# Altium schematic sheet screen.SchDoc
size A4; SheetNumber: 3; SheetTotal: 3
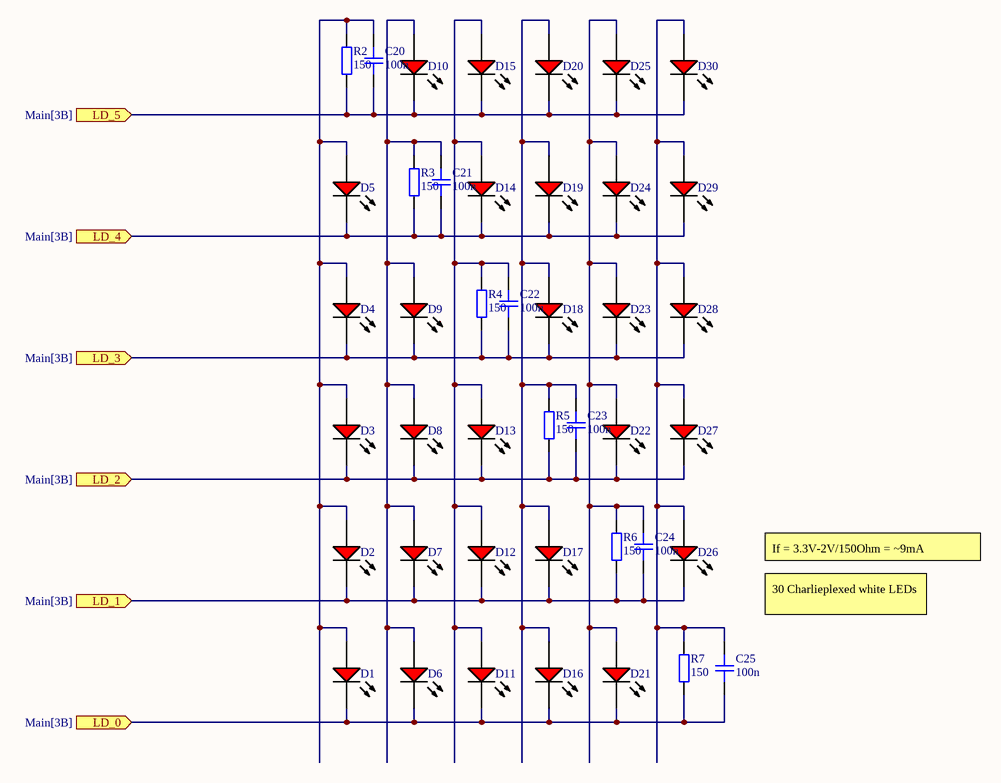
[diagram p0: screen.SchDoc]

## Parts
C20  100n  [CAP_0603]
C21  100n  [CAP_0603]
C22  100n  [CAP_0603]
C23  100n  [CAP_0603]
C24  100n  [CAP_0603]
C25  100n  [CAP_0603]
D1  SML-LX1206IC-TR  [LUMX-SML-LX1206IC_V]  (value not drawn)
D2  SML-LX1206IC-TR  [LUMX-SML-LX1206IC_V]  (value not drawn)
D3  SML-LX1206IC-TR  [LUMX-SML-LX1206IC_V]  (value not drawn)
D4  SML-LX1206IC-TR  [LUMX-SML-LX1206IC_V]  (value not drawn)
D5  SML-LX1206IC-TR  [LUMX-SML-LX1206IC_V]  (value not drawn)
D6  SML-LX1206IC-TR  [LUMX-SML-LX1206IC_V]  (value not drawn)
D7  SML-LX1206IC-TR  [LUMX-SML-LX1206IC_V]  (value not drawn)
D8  SML-LX1206IC-TR  [LUMX-SML-LX1206IC_V]  (value not drawn)
D9  SML-LX1206IC-TR  [LUMX-SML-LX1206IC_V]  (value not drawn)
D10  SML-LX1206IC-TR  [LUMX-SML-LX1206IC_V]  (value not drawn)
D11  SML-LX1206IC-TR  [LUMX-SML-LX1206IC_V]  (value not drawn)
D12  SML-LX1206IC-TR  [LUMX-SML-LX1206IC_V]  (value not drawn)
D13  SML-LX1206IC-TR  [LUMX-SML-LX1206IC_V]  (value not drawn)
D14  SML-LX1206IC-TR  [LUMX-SML-LX1206IC_V]  (value not drawn)
D15  SML-LX1206IC-TR  [LUMX-SML-LX1206IC_V]  (value not drawn)
D16  SML-LX1206IC-TR  [LUMX-SML-LX1206IC_V]  (value not drawn)
D17  SML-LX1206IC-TR  [LUMX-SML-LX1206IC_V]  (value not drawn)
D18  SML-LX1206IC-TR  [LUMX-SML-LX1206IC_V]  (value not drawn)
D19  SML-LX1206IC-TR  [LUMX-SML-LX1206IC_V]  (value not drawn)
D20  SML-LX1206IC-TR  [LUMX-SML-LX1206IC_V]  (value not drawn)
D21  SML-LX1206IC-TR  [LUMX-SML-LX1206IC_V]  (value not drawn)
D22  SML-LX1206IC-TR  [LUMX-SML-LX1206IC_V]  (value not drawn)
D23  SML-LX1206IC-TR  [LUMX-SML-LX1206IC_V]  (value not drawn)
D24  SML-LX1206IC-TR  [LUMX-SML-LX1206IC_V]  (value not drawn)
D25  SML-LX1206IC-TR  [LUMX-SML-LX1206IC_V]  (value not drawn)
D26  SML-LX1206IC-TR  [LUMX-SML-LX1206IC_V]  (value not drawn)
D27  SML-LX1206IC-TR  [LUMX-SML-LX1206IC_V]  (value not drawn)
D28  SML-LX1206IC-TR  [LUMX-SML-LX1206IC_V]  (value not drawn)
D29  SML-LX1206IC-TR  [LUMX-SML-LX1206IC_V]  (value not drawn)
D30  SML-LX1206IC-TR  [LUMX-SML-LX1206IC_V]  (value not drawn)
R2  150  [RES_0603]
R3  150  [RES_0603]
R4  150  [RES_0603]
R5  150  [RES_0603]
R6  150  [RES_0603]
R7  150  [RES_0603]

## Ports
LD_0 (in, see Main[3B]), LD_1 (in, see Main[3B]), LD_2 (in, see Main[3B]), LD_3 (in, see Main[3B]), LD_4 (in, see Main[3B]), LD_5 (in, see Main[3B])

## Nets
LD_0: C25.2 D1.2(K) D6.2(K) D11.2(K) D16.2(K) D21.2(K) R7.1 ; port LD_0
LD_1: C24.2 D2.2(K) D7.2(K) D12.2(K) D17.2(K) D26.2(K) R6.1 ; port LD_1
LD_2: C23.2 D3.2(K) D8.2(K) D13.2(K) D22.2(K) D27.2(K) R5.1 ; port LD_2
LD_3: C22.2 D4.2(K) D9.2(K) D18.2(K) D23.2(K) D28.2(K) R4.1 ; port LD_3
LD_4: C21.2 D5.2(K) D14.2(K) D19.2(K) D24.2(K) D29.2(K) R3.1 ; port LD_4
LD_5: C20.2 D10.2(K) D15.2(K) D20.2(K) D25.2(K) D30.2(K) R2.1 ; port LD_5
NetC20_1: C20.1 D1.1(A) D2.1(A) D3.1(A) D4.1(A) D5.1(A) R2.2
NetC21_1: C21.1 D6.1(A) D7.1(A) D8.1(A) D9.1(A) D10.1(A) R3.2
NetC22_1: C22.1 D11.1(A) D12.1(A) D13.1(A) D14.1(A) D15.1(A) R4.2
NetC23_1: C23.1 D16.1(A) D17.1(A) D18.1(A) D19.1(A) D20.1(A) R5.2
NetC24_1: C24.1 D21.1(A) D22.1(A) D23.1(A) D24.1(A) D25.1(A) R6.2
NetC25_1: C25.1 D26.1(A) D27.1(A) D28.1(A) D29.1(A) D30.1(A) R7.2

## Notes on the sheet
- If = 3.3V-2V/150Ohm = ~9mA
- 30 Charlieplexed white LEDs

## Library data of the parts
C20-C25 = CAP_0603: Capacitor SMD 0603, X7R, 10V; Manufacturer: *; Manufacturer Part Number: *; Distributor Link: *; LCSC: *; Rating: *; Dielectric: *
D1-D30 = CMP-2000-07123-1: LED Red, 65 mW, -40 to 85 degC, 2-Pin SMD, RoHS, Tape and Reel; Manufacturer: Lumex; LED Material: GaAsP; Peak Wavelength: 635nm; Number of LEDs: 1; Viewing Angle: 160; Reverse Voltage: 5(Min)V; Lens Appearance: ColorlessNonDiffused; Intensity: 6mcd; Type: Uni-Color; Pin_Count: 2; Lens Dimensions: 2x1.6x0.5mm; Mounting: SurfaceMount; ECCN: EAR99; RoHS: Unknown; Package Description: 2-Pin Surface Mount Device, Body 3.2 x 1.5 mm; Mounting Technology: SurfaceMount; Dominant Wavelength: N/A; Supplier_Package: SMD; Supplier Standard Pack: 3,000; Color: Red; Dimension: 3.2x1.6x1.1mm; HTS: 8541402000; Part No: SML-LX1206IC-TR; Family: SML-LX1206IC; Supplier: Lumex; Datasheet URL: http://www.lumex.com/content/files/ProductAttachment/SML-LX1206IC-TR.pdf; Package Reference: SML-LX1206IC; Manufacturer URL: http://www.lumexinstruments.com/; Operating Temperature: -25to85C; Packaging: TapeandReel; Datasheet Version: Rev. J, 08/2012
R2-R7 = RES_0603: Resistor SMD 0603; Manufacturer: *; Manufacturer Part Number: *; Distributor Link: *; LCSC: *